# Altium schematic sheet power.SCHDOC
size A
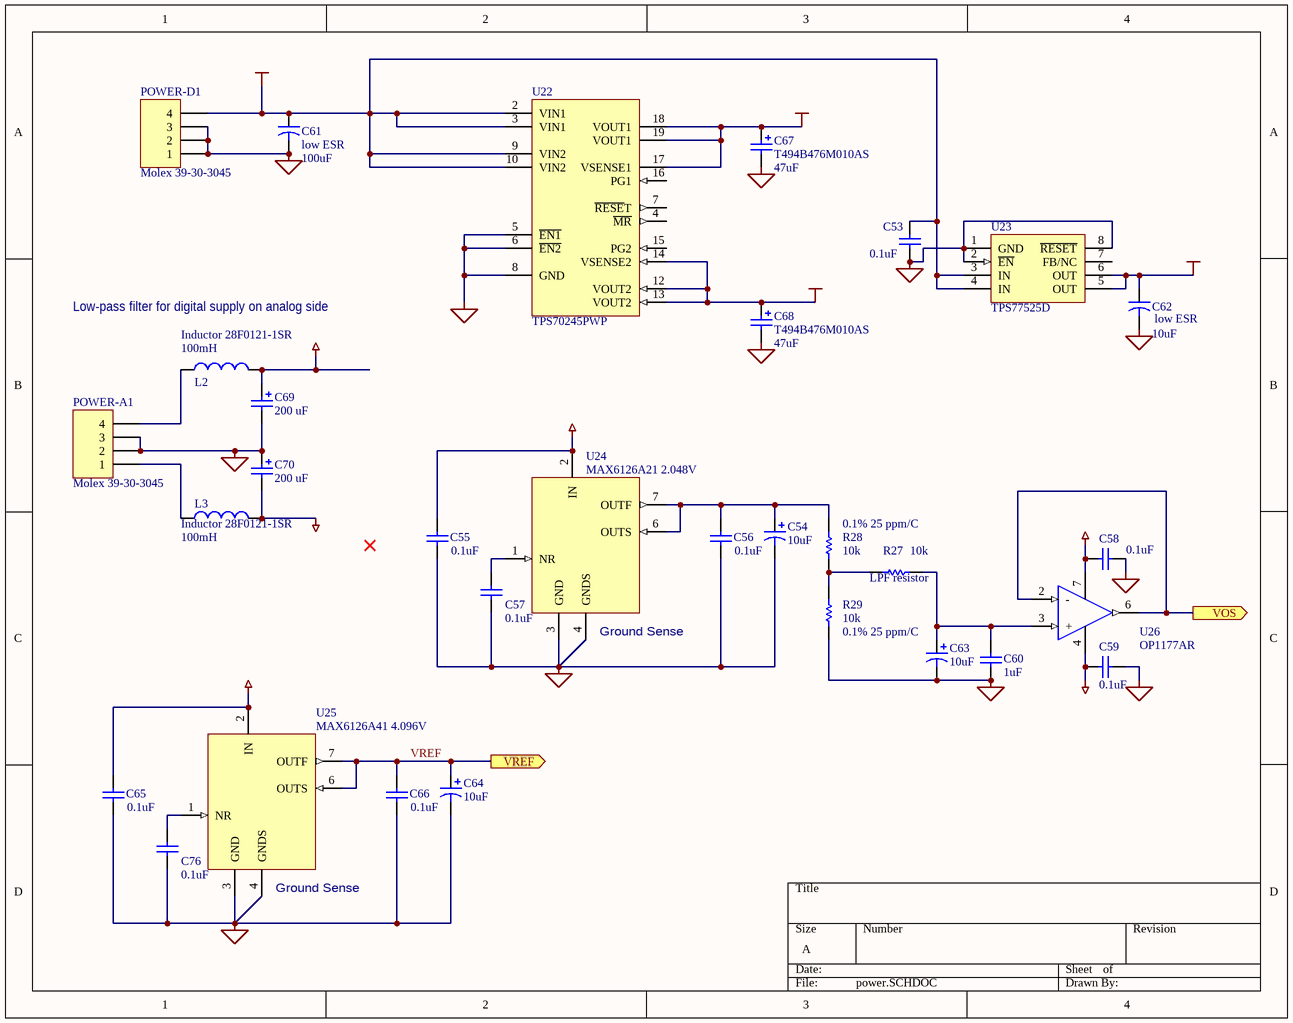
[diagram p0: power.SCHDOC]

## Parts
C53  value 0.1uF  [CC1608-0603]  (hidden comment: Cap)
C54  value 10uF  [TC3528-1411]  (hidden comment: Cap Pol1)
C55  value 0.1uF  [CC1608-0603]  (hidden comment: Cap)
C56  value 0.1uF  [CC1608-0603]  (hidden comment: Cap)
C57  value 0.1uF  [CC1608-0603]  (hidden comment: Cap)
C58  value 0.1uF  [CC1608-0603]  (hidden comment: Cap)
C59  value 0.1uF  [CC1608-0603]  (hidden comment: Cap)
C60  value 1uF  [CC1608-0603]  (hidden comment: Cap)
C61  low ESR  value 100uF  [PanasonicE]
C62  low ESR  value 10uF  [TC3528-1411]
C63  value 10uF  [TC3528-1411]  (hidden comment: Cap Pol1)
C64  value 10uF  [TC3528-1411]  (hidden comment: Cap Pol1)
C65  value 0.1uF  [CC1608-0603]  (hidden comment: Cap)
C66  value 0.1uF  [CC1608-0603]  (hidden comment: Cap)
C67  T494B476M010AS  value 47uF  [TC3528-1411]
C68  T494B476M010AS  value 47uF  [TC3528-1411]
C69  value 200 uF  [PanasonicE]
C70  value 200 uF  [PanasonicE]
C76  value 0.1uF  [CC1608-0603]  (hidden comment: Cap)
L2  Inductor 28F0121-1SR  value 100mH  [STEWARD_1SR]
L3  Inductor 28F0121-1SR  value 100mH  [STEWARD_1SR]
POWER-A1  Molex 39-30-3045  [MJ4RTHR]
POWER-D1  Molex 39-30-3045  [MJ4RTHR]
R27  LPF resistor  value 10k  [CC1608-0603]
R28  0.1% 25 ppm/C  value 10k  [CC1608-0603]
R29  0.1% 25 ppm/C  value 10k  [CC1608-0603]
U22  TPS70245PWP  [PWP PowerPad -20]
U23  TPS77525D  [SO-G8]
U24  MAX6126A21 2.048V  [TSSO3x5-G8/X.35]
U25  MAX6126A41 4.096V  [TSSO3x5-G8/X.35]
U26  OP1177AR  [TSSO3X5-G8/X.4]

## Ports
VOS (out), VREF (out)

## Nets
+1.2VCC: C68.1 U22.12(VOUT2) U22.13(VOUT2) U22.14(VSENSE2)
+2.5VCC: C62.1 U23.5(OUT) U23.6(OUT)
+5VCC: C53.1 C61.1 POWER-D1.4 U22.2(VIN1) U22.3(VIN1) U22.9(VIN2) U22.10(VIN2) U23.3(IN) U23.4(IN)
AGND: C54.2 C55.2 C56.2 C57.2 C58.1 C59.1 C60.2 C63.2 C64.2 C65.2 C66.2 C69.2 C70.1 C76.2 POWER-A1.2 POWER-A1.3 R29.1 U24.3(GND) U24.4(GNDS) U25.3(GND) U25.4(GNDS)
AVDD: C55.1 C58.2 C65.1 C69.1 L2.2 U24.2(IN) U25.2(IN) U26.7(+Vs)
AVSS: C59.2 C70.2 L3.2 U26.4(-Vs)
GND: C53.2 C61.2 C62.2 C67.2 C68.2 POWER-D1.1 POWER-D1.2 POWER-D1.3 U22.5(~{EN1}) U22.6(~{EN2}) U22.8(GND) U22.P1 U22.P2 U22.P3 U22.P4 U22.P5 U22.P6 U22.P7 U22.P8 U22.P9 U22.P10 U22.P11 U22.P12 U22.P13 U22.P14 U22.P15 U22.P16 U22.P17 U23.1(GND) U23.2(~{EN}) U23.8(~{RESET})
VCC: C67.1 U22.17(VSENSE1) U22.18(VOUT1) U22.19(VOUT1)
VOS: U26.2(-) U26.6(Out) ; port VOS
VREF: C64.1 C66.1 U25.6(OUTS) U25.7(OUTF) ; port VREF
NetC54_1: C54.1 C56.1 R28.2 U24.6(OUTS) U24.7(OUTF)
NetC57_1: C57.1 U24.1(NR)
NetC60_1: C60.1 C63.1 R27.1 U26.3(+)
NetC76_1: C76.1 U25.1(NR)
NetL2_1: L2.1 POWER-A1.4
NetL3_1: L3.1 POWER-A1.1
NetR27_2: R27.2 R28.1 R29.2

Not connected (* = marked no-connect by the designer): U22 4(~{MR}) 7(~{RESE}T) 15(PG2) 16(PG1); U23 7(FB/NC)

## Notes on the sheet
- Low-pass filter for digital supply on analog side
- (near U24) Ground Sense
- (near U25) Ground Sense

## Library data of the parts
C53 C55-C60 C65 C66 C76 = Cap: Capacitor; Manufacturer: Generic Components; Class I: Passive; Published: 8-Jun-2000; Revision: July-2002: Re-released for DXP Platform.; Publisher: Altium Limited; Class II: Capacitor
C54 C63 C64 = Cap Pol1: Polarized Capacitor (Radial); Published: 8-Jun-2000; LatestRevisionDate: 17-Jul-2002; LatestRevisionNote: Re-released for DXP Platform.; Publisher: Altium Limited
C61 C62 = Cap2: Capacitor; Manufacturer: Generic Components; Class I: Passive; Published: 23-Sep-2002; Publisher: Altium Limited; Class II: Capacitor
C67 C68 = Cap Pol1: Polarized Capacitor (Radial); Manufacturer: Generic Components; Class I: Passive; Published: 8-Jun-2000; Revision: July-2002: Re-released for DXP Platform.; Publisher: Altium Limited; Class II: Capacitor
C69 C70 = Cap Pol3: Polarized Capacitor (Surface Mount); Manufacturer: Generic Components; Class I: Passive; Published: 8-Jun-2000; Revision: July-2002: Re-released for DXP Platform.; Publisher: Altium Limited; Class II: Capacitor
L2 L3 = Inductor: Manufacturer: Generic Components; Class I: Passive; Published: 8-Jun-2000; Revision: July-2002: Re-released for DXP Platform.; Publisher: Altium Limited; Class II: Inductor
POWER-A1 POWER-D1 = Header 4: Header, 4-Pin; Manufacturer: Generic Components; Class I: Connector; Revision: July-2002: Re-released for DXP Platform.; Publisher: Altium Limited
R27-R29 = Res1: Resistor; Manufacturer: Generic Components; Class I: Passive; Published: 8-Jun-2000; Revision: July-2002: Re-released for DXP Platform.; Publisher: Altium Limited; Class II: Resistor
U22 = TPS70245PWP: TI dual-output low dropout voltage regulators; Vendor: Texas Instruments
U23 = TPS77525D: Fast-transient-response 500 mA low-dropout voltage regulator; Vendor: Texas Instruments
U24 U25 = MAX6126A21: Ultra-High-Precision, Ultra-Low-Noise, Series Voltage Reference; Vendor: Maxim Integrated Products
U26 = OP1177: Precision Low Noise, Low Input Bias Current Operational Amplifier; Vendor: Analog Devices